# Altium schematic sheet Cap-Touch.SchDoc
size A; SheetNumber: 8; SheetTotal: 12
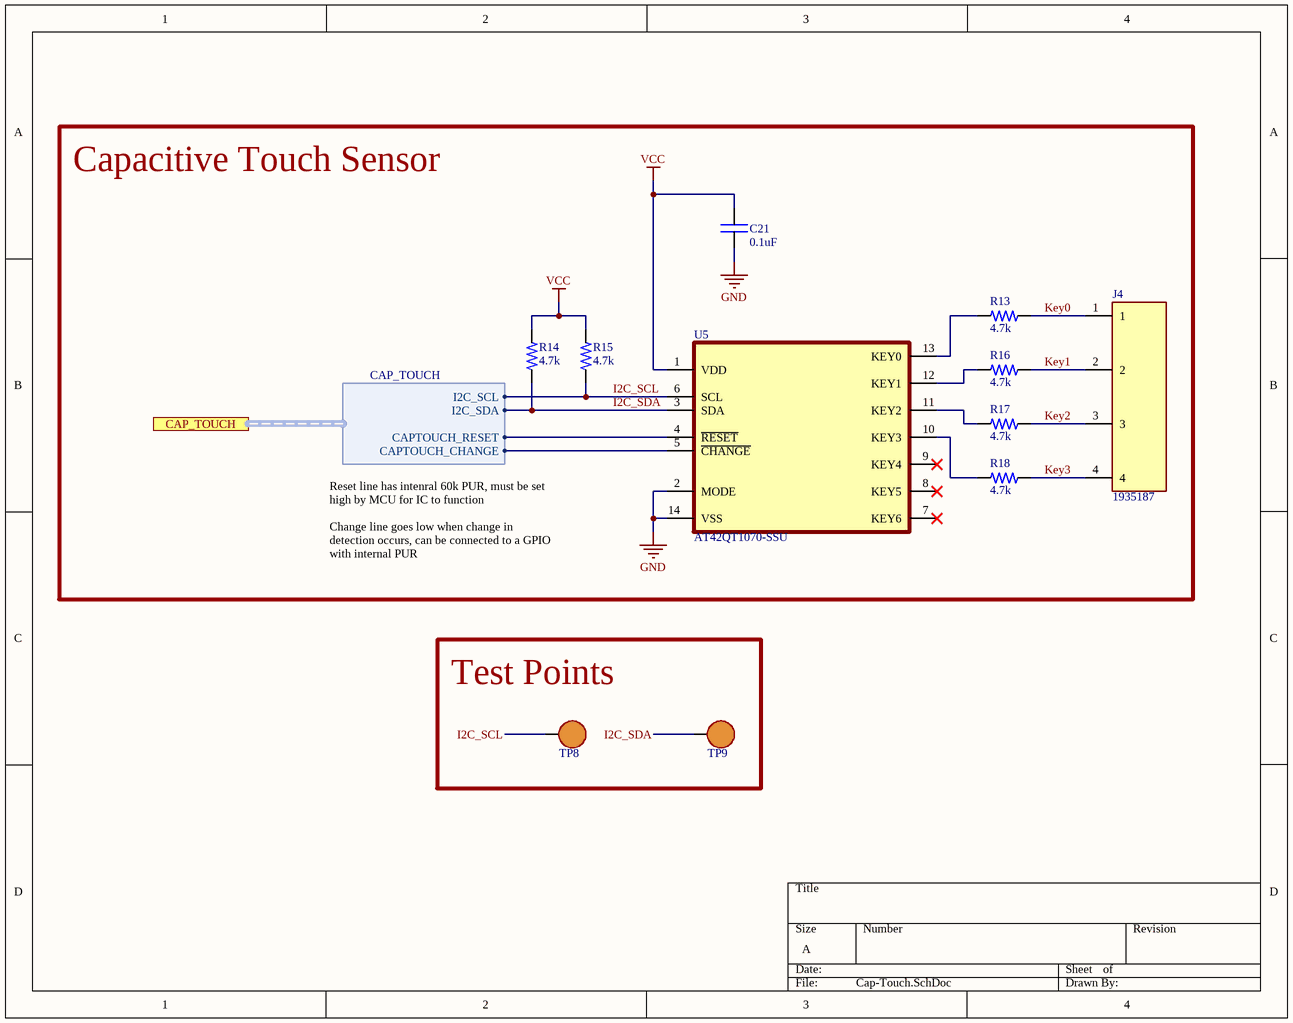
[diagram p0: Cap-Touch.SchDoc]

## Parts
C21  value 0.1uF  [0402C]  (hidden comment: CAP)
J4  1935187  [1935187]
R13  value 4.7k  [0402R]  (hidden comment: RES)
R14  value 4.7k  [0402R]  (hidden comment: RES)
R15  value 4.7k  [0402R]  (hidden comment: RES)
R16  value 4.7k  [0402R]  (hidden comment: RES)
R17  value 4.7k  [0402R]  (hidden comment: RES)
R18  value 4.7k  [0402R]  (hidden comment: RES)
TP8  RCWCTE  [RCWCTE]  (value not drawn)
TP9  RCWCTE  [RCWCTE]  (value not drawn)
U5  AT42QT1070-SSU  [14-SOIC]

## Blocks framed on the sheet
Capacitive Touch Sensor: C21 J4 R13-R18 U5
Test Points: TP8 TP9

## Ports
CAP_TOUCH (harness CAP_TOUCH, see Brain-PCB_MASTER[3B], MCU[1C])

## Harnesses
CAP_TOUCH: I2C_SCL, I2C_SDA, CAPTOUCH_RESET, CAPTOUCH_CHANGE

## Nets
GND: C21.1 U5.2(MODE) U5.14(VSS)
VCC: C21.2 R14.2 R15.2 U5.1(VDD)
I2C_SCL: R15.1 TP8.1 U5.6(SCL) ; port CAP_TOUCH.I2C_SCL
I2C_SDA: R14.1 TP9.1 U5.3(SDA) ; port CAP_TOUCH.I2C_SDA
Key0: J4.1 R13.1
Key1: J4.2 R16.1
Key2: J4.3 R17.1
Key3: J4.4 R18.1
NetR13_2: R13.2 U5.13(KEY0)
NetR16_2: R16.2 U5.12(KEY1)
NetR17_2: R17.2 U5.11(KEY2)
NetR18_2: R18.2 U5.10(KEY3)
NetU5_4: U5.4(~{RESET}) ; port CAP_TOUCH.CAPTOUCH_RESET
NetU5_5: U5.5(~{CHANGE}) ; port CAP_TOUCH.CAPTOUCH_CHANGE

Not connected (* = marked no-connect by the designer): U5 7(KEY6)* 8(KEY5)* 9(KEY4)*

## Notes on the sheet
- Reset line has intenral 60k PUR, must be set high by MCU for IC to function
  Change line goes low when change in detection occurs, can be connected to a GPIO with internal PUR

## Library data of the parts
C21 = CAP: Capacitor; MFR: Murata Electronics; MFR PN: GRM155R71C104KA88J; Type: SMD; Vendor: *; Vendor PN: *; Vendor Link: *
J4 = SCREW CONN 4 POS: Fixed Terminal Blocks PT 1.5/4-5.0-H; MFR: Phoenix Contact; MFR PN: 1935187; Type: TH
R13-R18 = RES: Resistor; MFR PN: AC0402FR-134K7L; MFR: YAGEO; Vendor: *; Vendor PN: *; Vendor Link: *; Type: SMD
TP8 TP9 = TEST POINT: Test Point, Surface Mount; MFR: KOA Speer Electronics, Inc.; MFR PN: RCWCTE; Type: SMD
U5 = AT42QT1070-SSU: Capacitive Touch Buttons 14-SOIC; MFR: Microchip; Value: *; MFR PN: AT42QT1070-SSU; Type: SMD